# EAGLE design voiceboard (EAGLE 9.6.2)
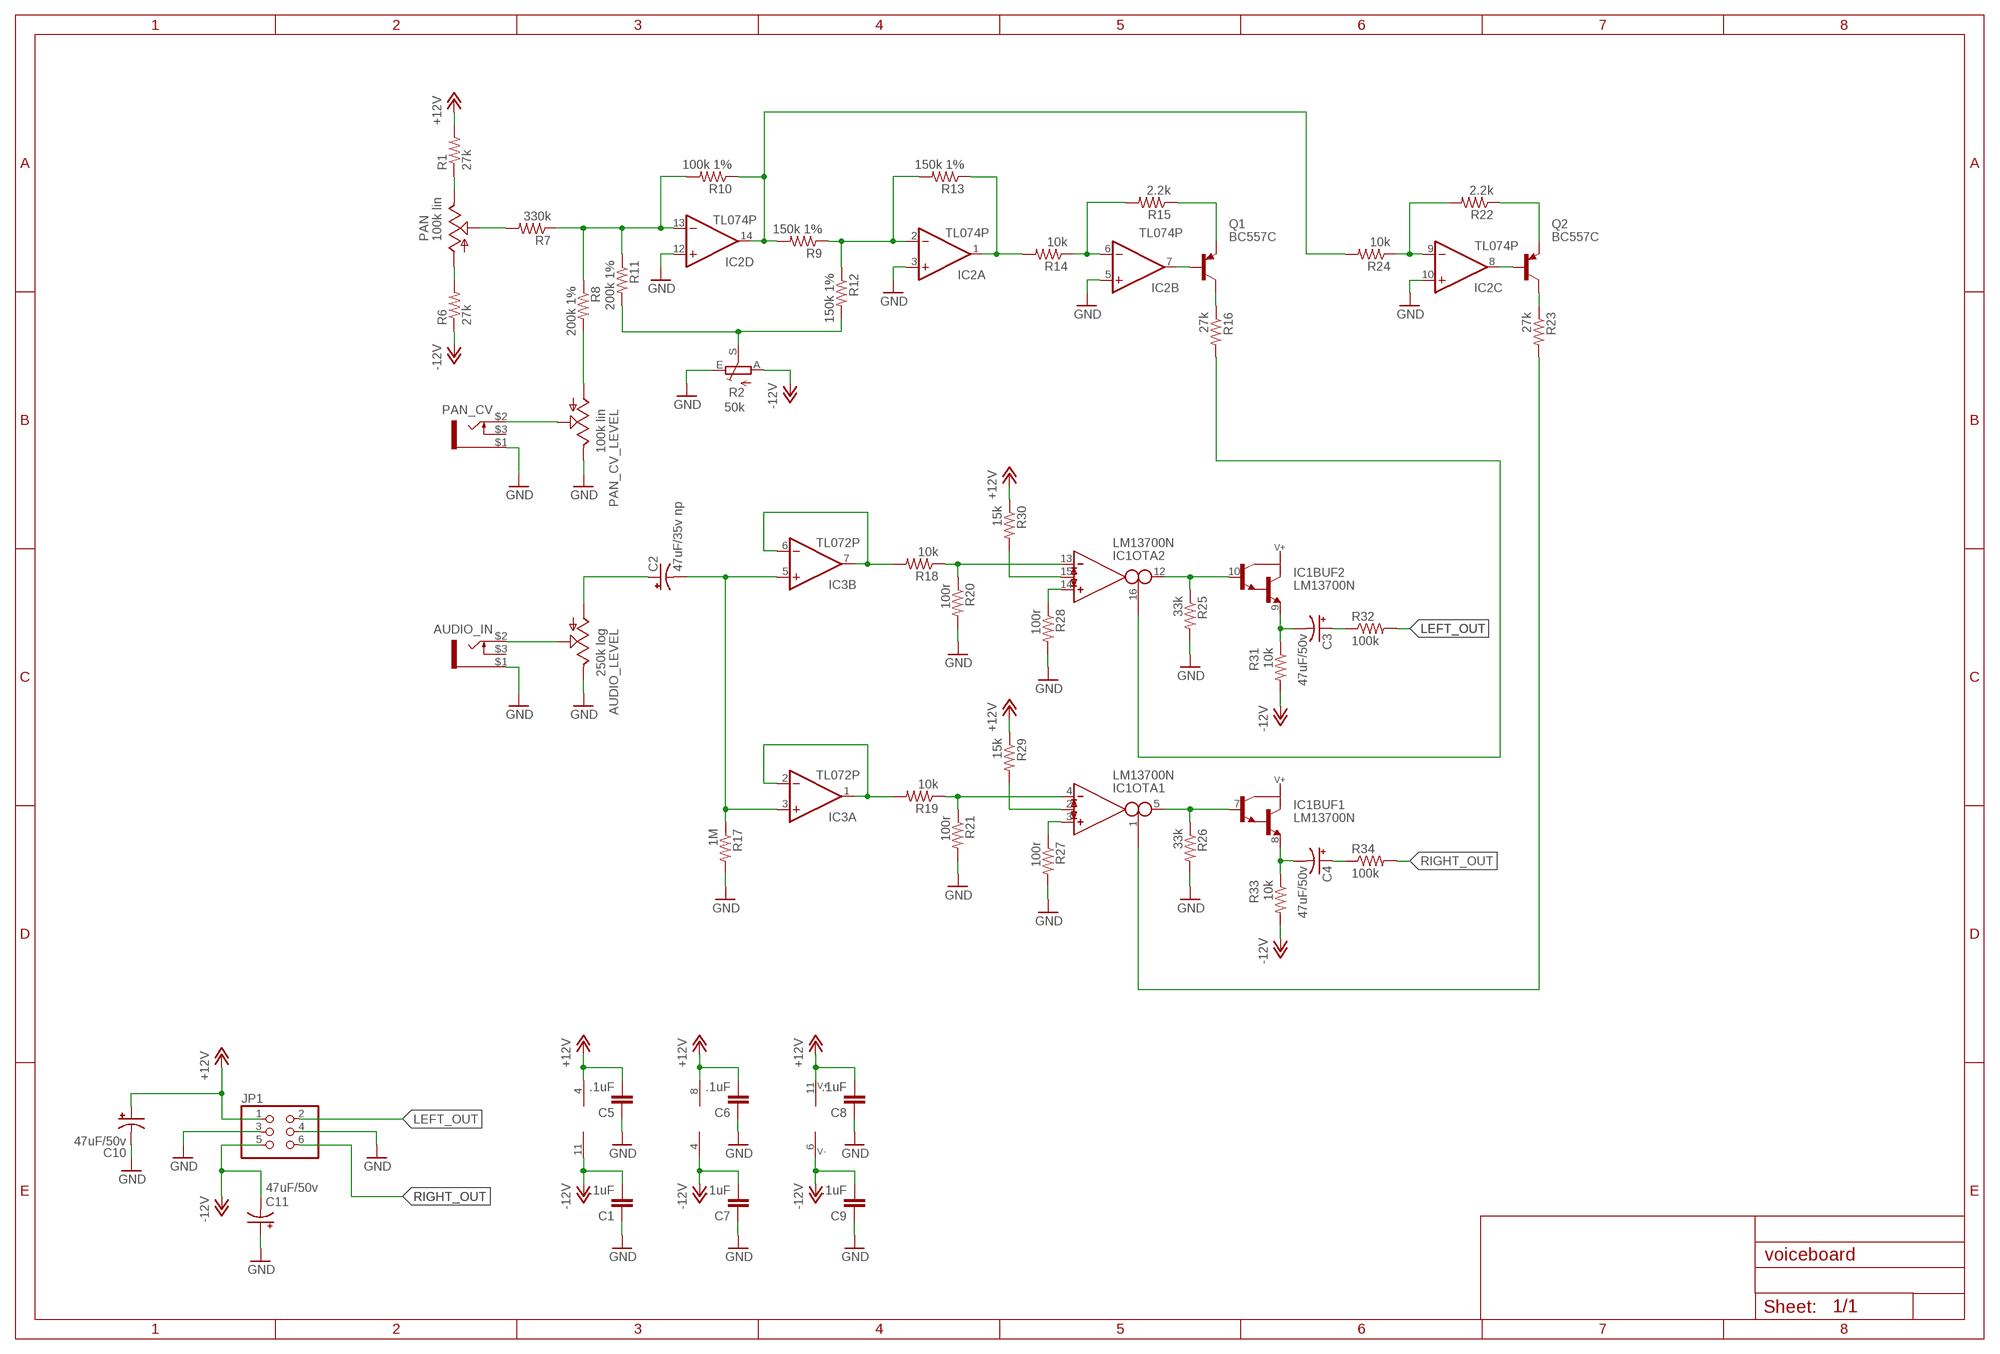
[diagram p0: schematic, sheet 1]

## Parts
AUDIO_IN  PJ-323PJ-323  [PJ-323]
AUDIO_LEVEL  250k log  RIGHT-ANGLE-POTF3A  [EVUF]
C1  .1uF  C-EU050-024X044  [C050-024X044]
C2  47uF/35v np  CPOL-USE5-10.5  [E5-10,5]
C3  47uF/50v  CPOL-USE2.5-6  [E2,5-6]
C4  47uF/50v  CPOL-USE2.5-6  [E2,5-6]
C5  .1uF  C-EU050-024X044  [C050-024X044]
C6  .1uF  C-EU050-024X044  [C050-024X044]
C7  .1uF  C-EU050-024X044  [C050-024X044]
C8  .1uF  C-EU050-024X044  [C050-024X044]
C9  .1uF  C-EU050-024X044  [C050-024X044]
C10  47uF/50v  CPOL-USE2.5-6  [E2,5-6]
C11  47uF/50v  CPOL-USE2.5-6  [E2,5-6]
IC1  LM13700N  [DIL16]
IC2  TL074P  [DIL14]
IC3  TL072P  [DIL08]
JP1  PINHD-2X3/90  [2X03/90]
PAN  100k lin  RIGHT-ANGLE-POTF3A  [EVUF]
PAN_CV  PJ-323PJ-323  [PJ-323]
PAN_CV_LEVEL  100k lin  RIGHT-ANGLE-POTF3A  [EVUF]
Q1  BC557C  [TO92-EBC]
Q2  BC557C  [TO92-EBC]
R1  27k  R-US_0207/7  [0207/7]
R2  50k  TRIM_1234-S64YW  [S64YW]
R6  27k  R-US_0207/7  [0207/7]
R7  330k  R-US_0207/7  [0207/7]
R8  200k 1%  R-US_0207/7  [0207/7]
R9  150k 1%  R-US_0207/7  [0207/7]
R10  100k 1%  R-US_0207/7  [0207/7]
R11  200k 1%  R-US_0207/7  [0207/7]
R12  150k 1%  R-US_0207/7  [0207/7]
R13  150k 1%  R-US_0207/7  [0207/7]
R14  10k  R-US_0207/7  [0207/7]
R15  2.2k  R-US_0207/7  [0207/7]
R16  27k  R-US_0207/7  [0207/7]
R17  1M  R-US_0207/7  [0207/7]
R18  10k  R-US_0207/7  [0207/7]
R19  10k  R-US_0207/7  [0207/7]
R20  100r  R-US_0207/7  [0207/7]
R21  100r  R-US_0207/7  [0207/7]
R22  2.2k  R-US_0207/7  [0207/7]
R23  27k  R-US_0207/7  [0207/7]
R24  10k  R-US_0207/7  [0207/7]
R25  33k  R-US_0207/7  [0207/7]
R26  33k  R-US_0207/7  [0207/7]
R27  100r  R-US_0207/7  [0207/7]
R28  100r  R-US_0207/7  [0207/7]
R29  15k  R-US_0207/7  [0207/7]
R30  15k  R-US_0207/7  [0207/7]
R31  10k  R-US_0207/7  [0207/7]
R32  100k  R-US_0207/7  [0207/7]
R33  10k  R-US_0207/7  [0207/7]
R34  100k  R-US_0207/7  [0207/7]

## Nets
+12V: C5.2 C6.2 C8.2 C10.+ IC1.11(SUPPLY:V+) IC2.4(P:V+) IC3.8(P:V+) JP1.1 R1.2 R29.1 R30.1
-12V: C1.2 C7.2 C9.2 C11.- IC1.6(SUPPLY:V-) IC2.11(P:V-) IC3.4(P:V-) JP1.5 R2.A R6.1 R31.2 R33.2
GND: AUDIO_IN.$1 AUDIO_LEVEL.3(E) C1.1 C5.1 C6.1 C7.1 C8.1 C9.1 C10.- C11.+ IC2.3(A:+IN) IC2.5(B:+IN) IC2.10(C:+IN) IC2.12(D:+IN) JP1.3 JP1.4 PAN_CV.$1 PAN_CV_LEVEL.3(E) R2.E R17.2 R20.2 R21.2 R25.2 R26.2 R27.2 R28.2
LEFT_OUT: JP1.2 R32.2
N$1: PAN.3(E) R1.1
N$2: PAN.1(A) R6.2
N$3: PAN.2(S) R7.2
N$4: PAN_CV.$2 PAN_CV_LEVEL.2(S)
N$5: IC2.13(D:-IN) R7.1 R8.1 R10.2 R11.1
N$6: IC2.14(D:OUT) R9.2 R10.1 R24.2
N$7: PAN_CV_LEVEL.1(A) R8.2
N$8: IC2.1(A:OUT) R13.1 R14.2
N$9: R2.S R11.2 R12.2
N$10: IC2.2(A:-IN) R9.1 R12.1 R13.2
N$11: IC2.6(B:-IN) R14.1 R15.2
N$12: IC2.7(B:OUT) Q1.B
N$13: Q1.C R16.1
N$14: Q1.E R15.1
N$15: AUDIO_IN.$2 AUDIO_LEVEL.2(S)
N$16: AUDIO_LEVEL.1(A) C2.+
N$17: C2.- IC3.3(A:+IN) IC3.5(B:+IN) R17.1
N$18: IC3.1(A:OUT) IC3.2(A:-IN) R19.2
N$19: IC3.6(B:-IN) IC3.7(B:OUT) R18.2
N$20: IC1.4(OTA1:IN_N) R19.1 R21.1
N$21: IC1.13(OTA2:IN_N) R18.1 R20.1
N$22: IC2.8(C:OUT) Q2.B
N$23: IC2.9(C:-IN) R22.2 R24.1
N$24: Q2.E R22.1
N$25: Q2.C R23.1
N$26: IC1.10(BUF2:B) IC1.12(OTA2:OUT) R25.1
N$27: IC1.5(OTA1:OUT) IC1.7(BUF1:B) R26.1
N$28: IC1.14(OTA2:IN_P) R28.1
N$29: IC1.3(OTA1:IN_P) R27.1
N$30: IC1.15(OTA2:I_DIODE) R30.2
N$31: IC1.2(OTA1:I_DIODE) R29.2
N$32: C3.- IC1.9(BUF2:E) R31.1
N$33: C3.+ R32.1
N$35: C4.- IC1.8(BUF1:E) R33.1
N$36: C4.+ R34.1
N$38: IC1.16(OTA2:I_BIAS) R16.2
N$39: IC1.1(OTA1:I_BIAS) R23.2
RIGHT_OUT: JP1.6 R34.2
Unconnected: AUDIO_IN.$3 PAN_CV.$3 R2.S@1(S)

## Library data of the parts
AUDIO_IN PAN_CV = gerbster:PJ-323
AUDIO_LEVEL PAN PAN_CV_LEVEL = gerbster:RIGHT-ANGLE-POT: 9 mm Square Rotary Potentiometers Source: Panasonic
C1 C5-C9 = rcl:C-EU: CAPACITOR, European symbol; SPICEPREFIX: C
C2-C4 C10 C11 = rcl:CPOL-US: POLARIZED CAPACITOR, American symbol; SPICEPREFIX: C
IC1 = ota:LM13700: Dual OTA with buffers
IC2 = linear:TL074: OP AMP
IC3 = TomW:TL072: OP AMP
JP1 = pinhead:PINHD-2X3: PIN HEADER
Q1 Q2 = transistor-pnp:BC557*: PNP Transistror
R1 R6-R34 = rcl:R-US_: RESISTOR, American symbol; SPICEPREFIX: R
R2 = pot:TRIM_1234-: POTENTIOMETER

## Board
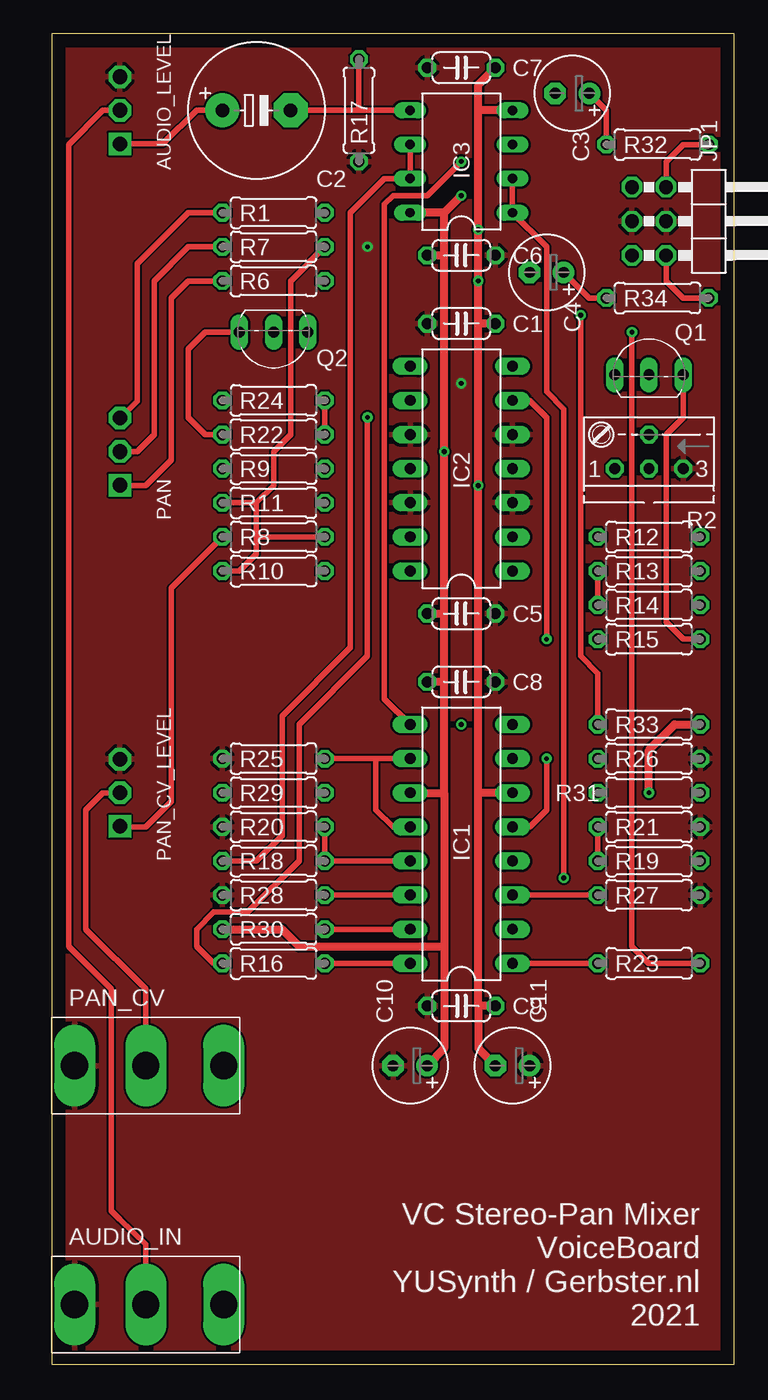
[diagram p1: board, top side]
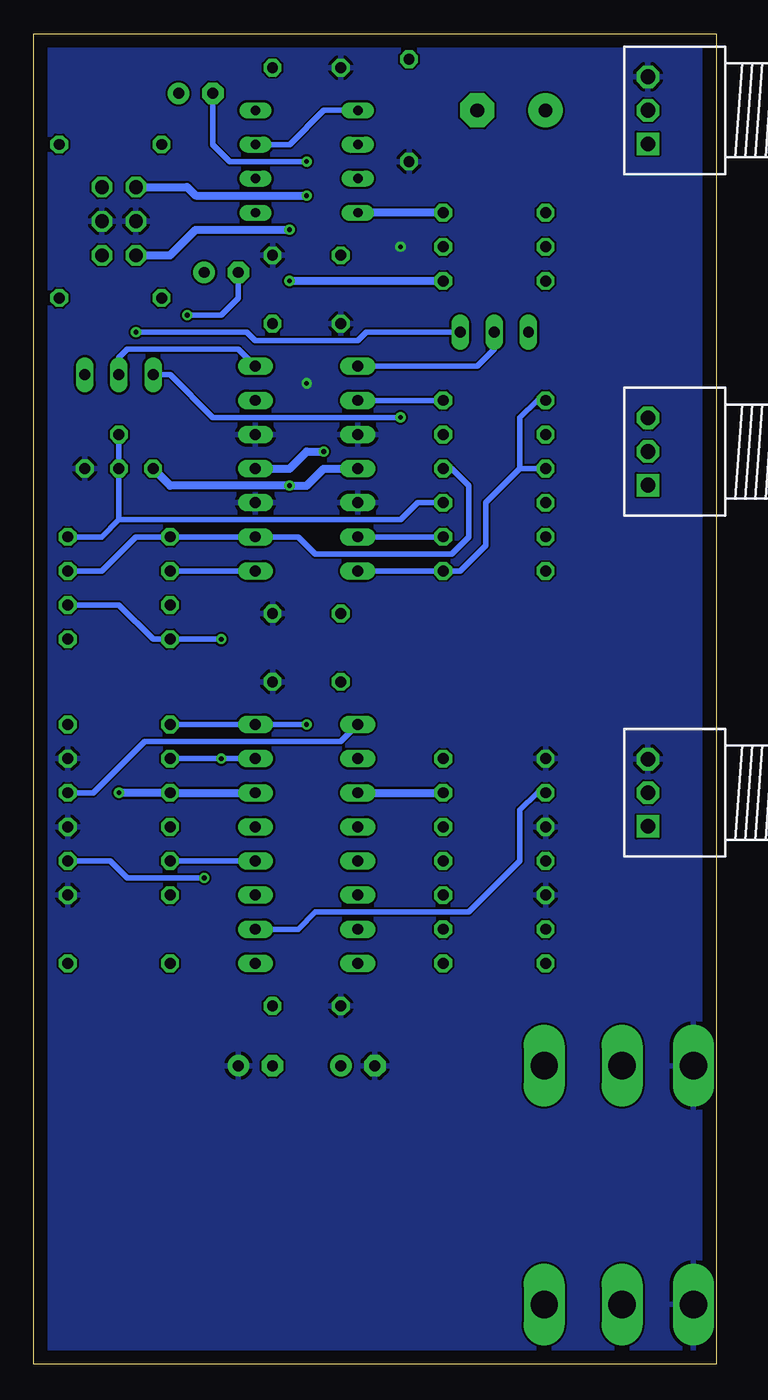
[diagram p2: board, bottom side, seen from below]

Size 50.8 x 99.06 mm. Coordinates in mm from the lower left corner, seen from the top.
Outline: 0,0 50.8,0 50.8,99.06 0,99.06 0,0
Copper layers (1*16): Top 0.035mm / dielectric 1.5mm / Bottom 0.035mm
Design rules "default": minimum track width 6mil, minimum drill 0.35mm, track to track 6mil, track to pad 6mil, pad to pad 6mil, via to via 6mil, smd to smd 6mil, copper to edge 40mil, drill to drill 6mil, minimum pad ring 10mil, minimum via ring 8mil, stop-mask expansion 4mil, vias tented up to drill 0mil, thermal gap 10mil

### Footprints (pad centres in the part's own frame; a part is rotated, then mirrored left to right if it is on the bottom)
PJ-323 = drill 2.032 pad 2.54 long: $1 0,-1.7; $2 0,-7; $3 0,-12.8
EVUF = drill 1.1 pad 1.676 square: 1 -2.5,0 | drill 1.1 pad 1.676 octagon: 2 0,0; 3 2.5,0
C050-024X044 = drill 0.813 octagon: 1 -2.54,0; 2 2.54,0
E5-10,5 = drill 1.016 pad 2.54: + -2.54,0 | drill 1.016 pad 2.54 octagon: - 2.54,0
E2,5-6 = drill 0.813 pad 1.6: + -1.27,0 | drill 0.813 pad 1.6 octagon: - 1.27,0
DIL16 = drill 0.813 long: 1 -8.89,-3.81; 2 -6.35,-3.81; 3 -3.81,-3.81; 4 -1.27,-3.81; 5 1.27,-3.81; 6 3.81,-3.81; 7 6.35,-3.81; 8 8.89,-3.81; 9 8.89,3.81; 10 6.35,3.81; 11 3.81,3.81; 12 1.27,3.81; 13 -1.27,3.81; 14 -3.81,3.81; 15 -6.35,3.81; 16 -8.89,3.81
DIL14 = drill 0.813 long: 1 -7.62,-3.81; 2 -5.08,-3.81; 3 -2.54,-3.81; 4 0,-3.81; 5 2.54,-3.81; 6 5.08,-3.81; 7 7.62,-3.81; 8 7.62,3.81; 9 5.08,3.81; 10 2.54,3.81; 11 0,3.81; 12 -2.54,3.81; 13 -5.08,3.81; 14 -7.62,3.81
DIL08 = drill 0.7 long: 1 -3.81,-3.81; 2 -1.27,-3.81; 3 1.27,-3.81; 4 3.81,-3.81; 5 3.81,3.81; 6 1.27,3.81; 7 -1.27,3.81; 8 -3.81,3.81
2X03/90 = drill 1.016 octagon: 1 -2.54,-6.35; 2 -2.54,-3.81; 3 0,-6.35; 4 0,-3.81; 5 2.54,-6.35; 6 2.54,-3.81
TO92-EBC = drill 0.813 long: B 0,-1.27; C -2.54,-1.27; E 2.54,-1.27
0207/7 = drill 0.813 octagon: 1 -3.81,0; 2 3.81,0
S64YW = drill 0.813 octagon: A 2.54,1.27; E -2.54,1.27; S 0,-1.27; S@1 0,1.27

### Placement (x,y rotation side)
AUDIO_IN  0,4.45 90 top
AUDIO_LEVEL  5.08,93.34 90 top
C1  30.48,77.47 0 top
C2  15.24,93.34 0 top
C3  38.73,94.61 180 top
C4  36.83,81.28 180 top
C5  30.48,55.88 180 top
C6  30.48,82.55 180 top
C7  30.48,96.52 0 top
C8  30.48,50.8 180 top
C9  30.48,26.67 0 top
C10  26.67,22.23 180 top
C11  34.29,22.23 180 top
IC1  30.48,38.73 90 top
IC2  30.48,66.67 90 top
IC3  30.48,89.53 90 top
JP1  49.53,85.09 270 top
PAN  5.08,67.94 90 top
PAN_CV  0,22.23 90 top
PAN_CV_LEVEL  5.08,42.55 90 top
Q1  44.45,74.93 0 top
Q2  16.51,75.56 180 top
R1  16.51,85.72 0 top
R2  44.45,67.94 180 top
R6  16.51,80.64 180 top
R7  16.51,83.19 180 top
R8  16.51,61.59 180 top
R9  16.51,66.67 180 top
R10  16.51,59.05 180 top
R11  16.51,64.14 0 top
R12  44.45,61.59 0 top
R13  44.45,59.05 0 top
R14  44.45,56.52 180 top
R15  44.45,53.98 180 top
R16  16.51,29.84 0 top
R17  22.86,93.34 270 top
R18  16.51,37.47 180 top
R19  44.45,37.47 0 top
R20  16.51,40.01 180 top
R21  44.45,40.01 0 top
R22  16.51,69.22 0 top
R23  44.45,29.84 180 top
R24  16.51,71.75 180 top
R25  16.51,45.09 180 top
R26  44.45,45.09 0 top
R27  44.45,34.92 0 top
R28  16.51,34.92 180 top
R29  16.51,42.55 180 top
R30  16.51,32.38 0 top
R31  44.45,42.55 180 top
R32  45.09,90.81 0 top
R33  44.45,47.62 0 top
R34  45.09,79.38 0 top

### Tracks (layer width: path | path; a pad name or v marks a point on that pad's centre or on a via)
+12V  (via drill 0.35)
  Top 0.61: IC1.11 29.21,42.55 | 29.21,42.55 29.21,50.8 | 29.21,50.8 C8.2 | 29.21,85.72 IC3.8 | 29.21,50.8 29.21,55.88 | 29.21,55.88 v29.21,67.94 29.21,82.55 | 29.21,82.55 29.21,85.72 | C6.2 29.21,82.55 | C5.2 29.21,55.88 | v30.48,87 29.21,85.72 | 29.21,42.55 29.21,31.11 | 29.21,31.11 29.21,23.5 C10.+ | R30.1 17.14,32.38 18.41,31.11 29.21,31.11
  Bottom 0.61: R1.2 IC3.8 | IC2.4 31.75,66.67 30.48,67.94 v29.21,67.94 | JP1.1 39.37,87.63 38.73,87 v30.48,87 | IC1.11 R29.1
-12V  (via drill 0.35)
  Top 0.61: v44.45,42.55 44.45,45.72 46.35,47.62 R33.2 | C9.2 31.75,26.67 | 31.75,26.67 31.75,42.55 | IC1.6 31.75,42.55 | 31.75,42.55 v31.75,65.41 31.75,77.47 | IC3.4 31.75,93.34 | 31.75,93.34 31.75,95.25 C7.2 | C1.2 31.75,77.47 | 31.75,77.47 v31.75,80.64 v31.75,84.45 31.75,93.34 | 31.75,26.67 31.75,23.5 C11.-
  Bottom 0.61: IC1.6 R31.2 v44.45,42.55 | IC2.11 29.21,66.67 30.48,65.41 v31.75,65.41 40.64,65.41 R2.A | R6.1 v31.75,80.64 | JP1.5 40.64,82.55 38.73,84.45 v31.75,84.45
GND  (via drill 0.35)
  other vias: 23.5,83.19 30.48,73.03
  pour Top: 0,99.06 0,0 50.8,0 50.8,99.06
  pour Bottom: 0,99.06 0,0 50.8,0 50.8,99.06
LEFT_OUT
  Top 0.406: JP1.2 45.72,89.53 46.99,90.81 R32.2
N$1
  Top 0.406: PAN.3 6.35,71.72 6.35,81.92 10.16,85.72 R1.1
N$2
  Top 0.406: R6.2 10.16,80.64 8.89,79.38 8.89,67.31 6.99,65.41 5.08,65.41 PAN.1
N$3
  Top 0.406: PAN.2 6.35,67.94 7.62,69.22 7.62,80.64 10.16,83.19 R7.2
N$4
  Top 0.406: PAN_CV.$2 6.99,27.94 2.54,32.38 2.54,41.27 3.81,42.55 PAN_CV_LEVEL.2
N$5
  Top 0.406: R11.1 15.24,64.14 | 15.24,64.14 15.24,61.59 | 15.24,61.59 R8.1 | R10.2 13.97,59.05 15.24,60.33 15.24,61.59 | R7.1 17.78,80.64 17.78,69.22 16.51,67.94 16.51,65.41 15.24,64.14
  Bottom 0.406: R8.1 IC2.13
N$6
  Bottom 0.406: IC2.14 R10.1 19.05,59.05 17.14,60.96 17.14,64.14 14.61,66.67 | R24.2 13.34,71.75 14.61,70.48 14.61,66.67 | 14.61,66.67 R9.2
N$7
  Top 0.406: PAN_CV_LEVEL.1 5.08,40.01 6.99,40.01 8.89,41.91 8.89,57.78 R8.2
N$8
  Top 0.406: R13.1 R14.2
  Bottom 0.406: IC2.1 R13.1
N$9
  Bottom 0.406: R11.2 22.23,64.14 23.5,62.87 44.45,62.87 | 44.45,62.87 45.72,61.59 R12.2 | R2.S 44.45,62.87
N$10
  Bottom 0.406: R9.1 19.68,66.67 18.41,65.41 18.41,61.59 19.68,60.33 29.84,60.33 31.11,61.59 IC2.2 R12.1 43.18,61.59 45.72,59.05 R13.2
N$11  (via drill 0.35)
  Top 0.406: IC2.6 35.56,71.75 36.83,70.48 v36.83,53.98
  Bottom 0.406: R14.1 44.45,56.52 41.91,53.98 R15.2 v36.83,53.98
N$12
  Bottom 0.406: IC2.7 35.56,75.56 43.81,75.56 44.45,74.93 Q1.B
N$13  (via drill 0.35)
  Top 0.406: v23.5,70.48 23.5,52.7 18.41,47.62 18.41,37.47 14.61,33.66 12.06,33.66 10.79,32.38 10.79,31.11 12.06,29.84 R16.1
  Bottom 0.406: v23.5,70.48 37.47,70.48 40.64,73.66 Q1.C
N$14
  Top 0.406: Q1.E 46.99,70.48 45.72,69.22 45.72,55.24 46.99,53.98 R15.1
N$15
  Top 0.406: AUDIO_LEVEL.2 3.81,93.34 1.27,90.81 1.27,31.11 4.45,27.94 4.45,11.43 5.08,10.79 7,8.91 AUDIO_IN.$2
N$16
  Top 0.406: C2.+ 10.79,93.34 8.26,90.84 AUDIO_LEVEL.1
N$17
  Top 0.406: 22.86,93.34 IC3.5 | C2.- 22.86,93.34 | 22.86,93.34 R17.1
  Bottom 0.406: IC3.5 29.21,93.34 31.75,90.81 IC3.3
N$18  (via drill 0.35)
  Top 0.406: IC3.2 IC3.1 36.83,83.19 36.83,72.39 38.1,71.12 v38.1,36.2
  Bottom 0.406: v38.1,36.2 43.81,36.2 45.09,37.47 R19.2
N$19
  Top 0.406: IC3.6 IC3.7 24.77,88.27 22.23,85.72 22.23,53.34 17.14,48.26 17.14,39.37 15.24,37.47 R18.2
N$20
  Top 0.406: R21.1 R19.1
  Bottom 0.406: IC1.4 R19.1
N$21
  Top 0.406: R20.1 R18.1 IC1.13
N$22
  Bottom 0.406: IC2.8 17.78,74.3 16.51,75.56 Q2.B
N$23
  Top 0.406: R24.1 R22.2
  Bottom 0.406: R24.1 IC2.9
N$24
  Top 0.406: R22.1 11.43,69.22 10.16,70.48 10.16,75.56 11.43,76.83 Q2.E
N$25  (via drill 0.35)
  Top 0.406: R23.1 44.45,29.84 43.18,31.11 v43.18,76.83
  Bottom 0.406: v43.18,76.83 34.92,76.83 34.29,76.2 26.67,76.2 26.04,76.83 Q2.C
N$26
  Top 0.406: R25.1 24.13,45.09 | 24.13,45.09 IC1.10 | IC1.12 25.4,40.01 24.13,41.27 24.13,45.09
N$27  (via drill 0.35)
  Top 0.406: IC1.5 35.56,40.01 36.83,41.27 v36.83,45.09
  Bottom 0.406: R26.1 v36.83,45.09 IC1.7
N$28
  Top 0.406: IC1.14 R28.1
N$29
  Top 0.406: IC1.3 R27.1
N$30
  Top 0.406: IC1.15 R30.2
N$31
  Bottom 0.406: R29.2 13.34,42.55 14.61,41.27 14.61,37.47 18.41,33.66 29.84,33.66 31.11,32.38 IC1.2
N$32  (via drill 0.35)
  Top 0.406: v30.48,89.53 27.94,87 25.4,87 24.77,86.36 24.77,49.53 IC1.9
  Bottom 0.406: R31.1 46.35,42.55 42.55,46.35 27.94,46.35 IC1.9 | C3.- 37.47,90.81 36.2,89.53 v30.48,89.53
N$33
  Top 0.406: C3.+ 41.27,93.34 R32.1
N$35  (via drill 0.35)
  Top 0.406: R33.1 40.64,51.44 39.37,52.7 v39.37,78.11
  Bottom 0.406: R33.1 IC1.8 v30.48,47.62 | v39.37,78.11 36.83,78.11 35.56,79.38 C4.-
N$36
  Top 0.406: C4.+ 40.01,79.38 R34.1
N$38
  Top 0.406: IC1.16 R16.2
N$39
  Top 0.406: IC1.1 R23.2
RIGHT_OUT
  Top 0.406: R34.2 46.99,79.38 45.72,80.64 JP1.6

### Text on the board
tNames: VC Stereo-Pan Mixer / VoiceBoard / YUSynth / Gerbster.nl / 2021